# EAGLE design mini-v1.14-macrofab-rtg (EAGLE 7.5.0)

## Sheet 1 of 4: Main Microcontroller
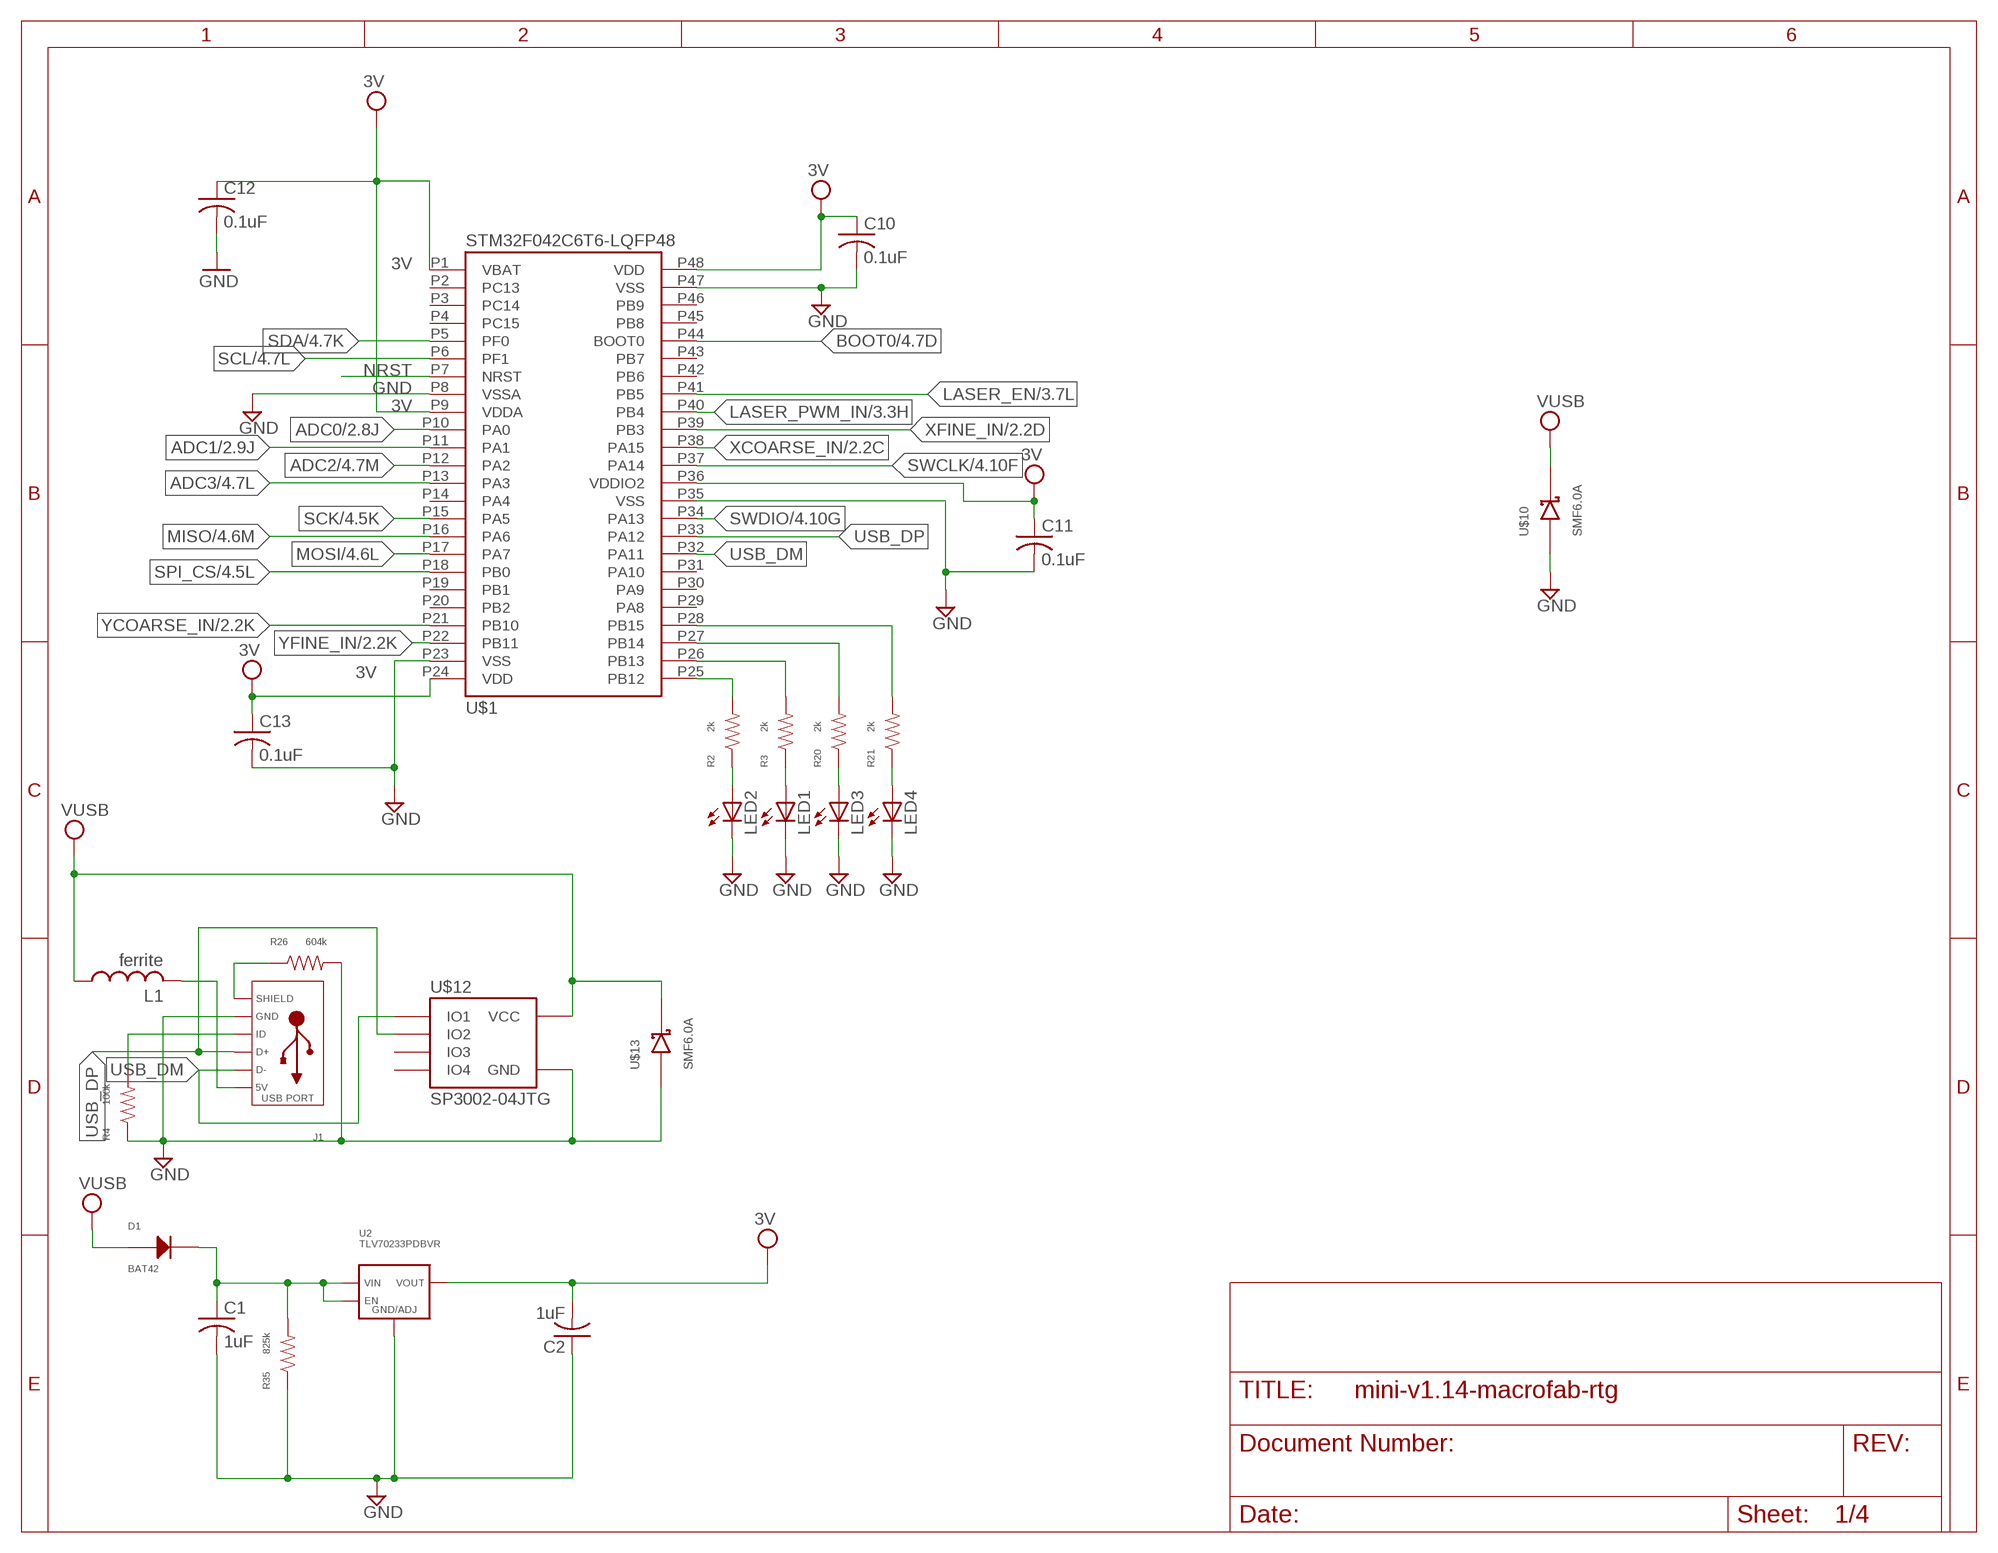
[diagram p0: schematic, sheet 1]

### Parts
C1  1uF  C-USC0603  [C0603]
C2  1uF  C-USC0603  [C0603]
C10  0.1uF  C-USC0603  [C0603]
C11  0.1uF  C-USC0603  [C0603]
C12  0.1uF  C-USC0603  [C0603]
C13  0.1uF  C-USC0603  [C0603]
D1  BAT42  DIODE_SOD-123  [SOD-123]
J1  USB_MICRO_RIGHT  [MICROUSB-RIGHT]
L1  ferrite  L-US  [C0603]
LED1  LEDCHIP-LED0603  [CHIP-LED0603]
LED2  LEDCHIP-LED0603  [CHIP-LED0603]
LED3  LEDCHIP-LED0603  [CHIP-LED0603]
LED4  LEDCHIP-LED0603  [CHIP-LED0603]
R2  2k  RESISTOR_0603  [R0603]
R3  2k  RESISTOR_0603  [R0603]
R4  100k  RESISTOR_0603  [R0603]
R20  2k  RESISTOR_0603  [R0603]
R21  2k  RESISTOR_0603  [R0603]
R26  604k  RESISTOR_0603  [R0603]
R35  825k  RESISTOR_0603  [R0603]
U2  TLV70233PDBVR  [SOT-23-5]
U$1  STM32F042C6T6-LQFP48  STM32F042-LQFP48  [LQFP48]
U$10  SMF6.0A  MBR0520  [SOD123]
U$12  SP3002-04JTG  SP3002  [SC70-6]
U$13  SMF6.0A  MBR0520  [SOD123]

### Nets
3V: C2.2 C10.1 C11.1 C12.1 C13.1 U2.P$5(VOUT) U$1.P1(VBAT) U$1.P9(VDDA) U$1.P24(VDD) U$1.P36(VDDIO2) U$1.P48(VDD) ; also sheet 2,4
ADC0: U$1.P10(PA0) ; also sheet 2
ADC1: U$1.P11(PA1) ; also sheet 2
ADC2: U$1.P12(PA2) ; also sheet 4
ADC3: U$1.P13(PA3) ; also sheet 4
BOOT0: U$1.P44(BOOT0) ; also sheet 4
GND [Power]: C1.2 C2.1 C10.2 C11.2 C12.2 C13.2 J1.5(GND) LED1.C LED2.C LED3.C LED4.C R4.P$1 R26.P$2 R35.P$1 U2.P$2(GND/ADJ) U$1.P8(VSSA) U$1.P23(VSS) U$1.P35(VSS) U$1.P47(VSS) U$10.ANODE U$12.P2(GND) U$13.ANODE ; also sheet 2,3,4
LASER_EN: U$1.P41(PB5) ; also sheet 3
LASER_PWM_IN: U$1.P40(PB4) ; also sheet 3
MISO: U$1.P16(PA6) ; also sheet 4
MOSI: U$1.P17(PA7) ; also sheet 4
N$2: R2.P$2 U$1.P25(PB12)
N$3: LED2.A R2.P$1
N$4: C1.1 D1.CATHODE R35.P$2 U2.P$1(VIN) U2.P$3(EN)
N$5: J1.4(ID) R4.P$2
N$12: LED1.A R3.P$1
N$13: R3.P$2 U$1.P26(PB13)
N$14: J1.1(5V) L1.2
N$18: J1.S1(SLD) J1.S2(SLD) J1.S3(SLD) J1.S4(SLD) J1.S5(SLD) J1.S6(SLD) R26.P$1
N$24: LED3.A R20.P$1
N$27: LED4.A R21.P$1
N$28: R20.P$2 U$1.P27(PB14)
N$29: R21.P$2 U$1.P28(PB15)
NRST: U$1.P7(NRST) ; also sheet 4
SCK: U$1.P15(PA5) ; also sheet 4
SCL: U$1.P6(PF1) ; also sheet 4
SDA: U$1.P5(PF0) ; also sheet 4
SPI_CS: U$1.P18(PB0) ; also sheet 4
SWCLK: U$1.P37(PA14) ; also sheet 4
SWDIO: U$1.P34(PA13) ; also sheet 4
USB_DM: J1.2(D-) U$1.P32(PA11) U$12.P1(IO1)
USB_DP: J1.3(D+) U$1.P33(PA12) U$12.P3(IO2)
VUSB [Power]: D1.ANODE L1.1 U$10.CATHODE U$12.P5(VCC) U$13.CATHODE ; also sheet 2,3,4
XCOARSE_IN: U$1.P38(PA15) ; also sheet 2
XFINE_IN: U$1.P39(PB3) ; also sheet 2
YCOARSE_IN: U$1.P21(PB10) ; also sheet 2
YFINE_IN: U$1.P22(PB11) ; also sheet 2
Unconnected: U$1.P2(PC13) U$1.P3(PC14) U$1.P4(PC15) U$1.P14(PA4) U$1.P19(PB1) U$1.P20(PB2) U$1.P29(PA8) U$1.P30(PA9) U$1.P31(PA10) U$1.P42(PB6) U$1.P43(PB7) U$1.P45(PB8) U$1.P46(PB9) U$12.P4(IO3) U$12.P6(IO4)

## Sheet 2 of 4: Dual PWM
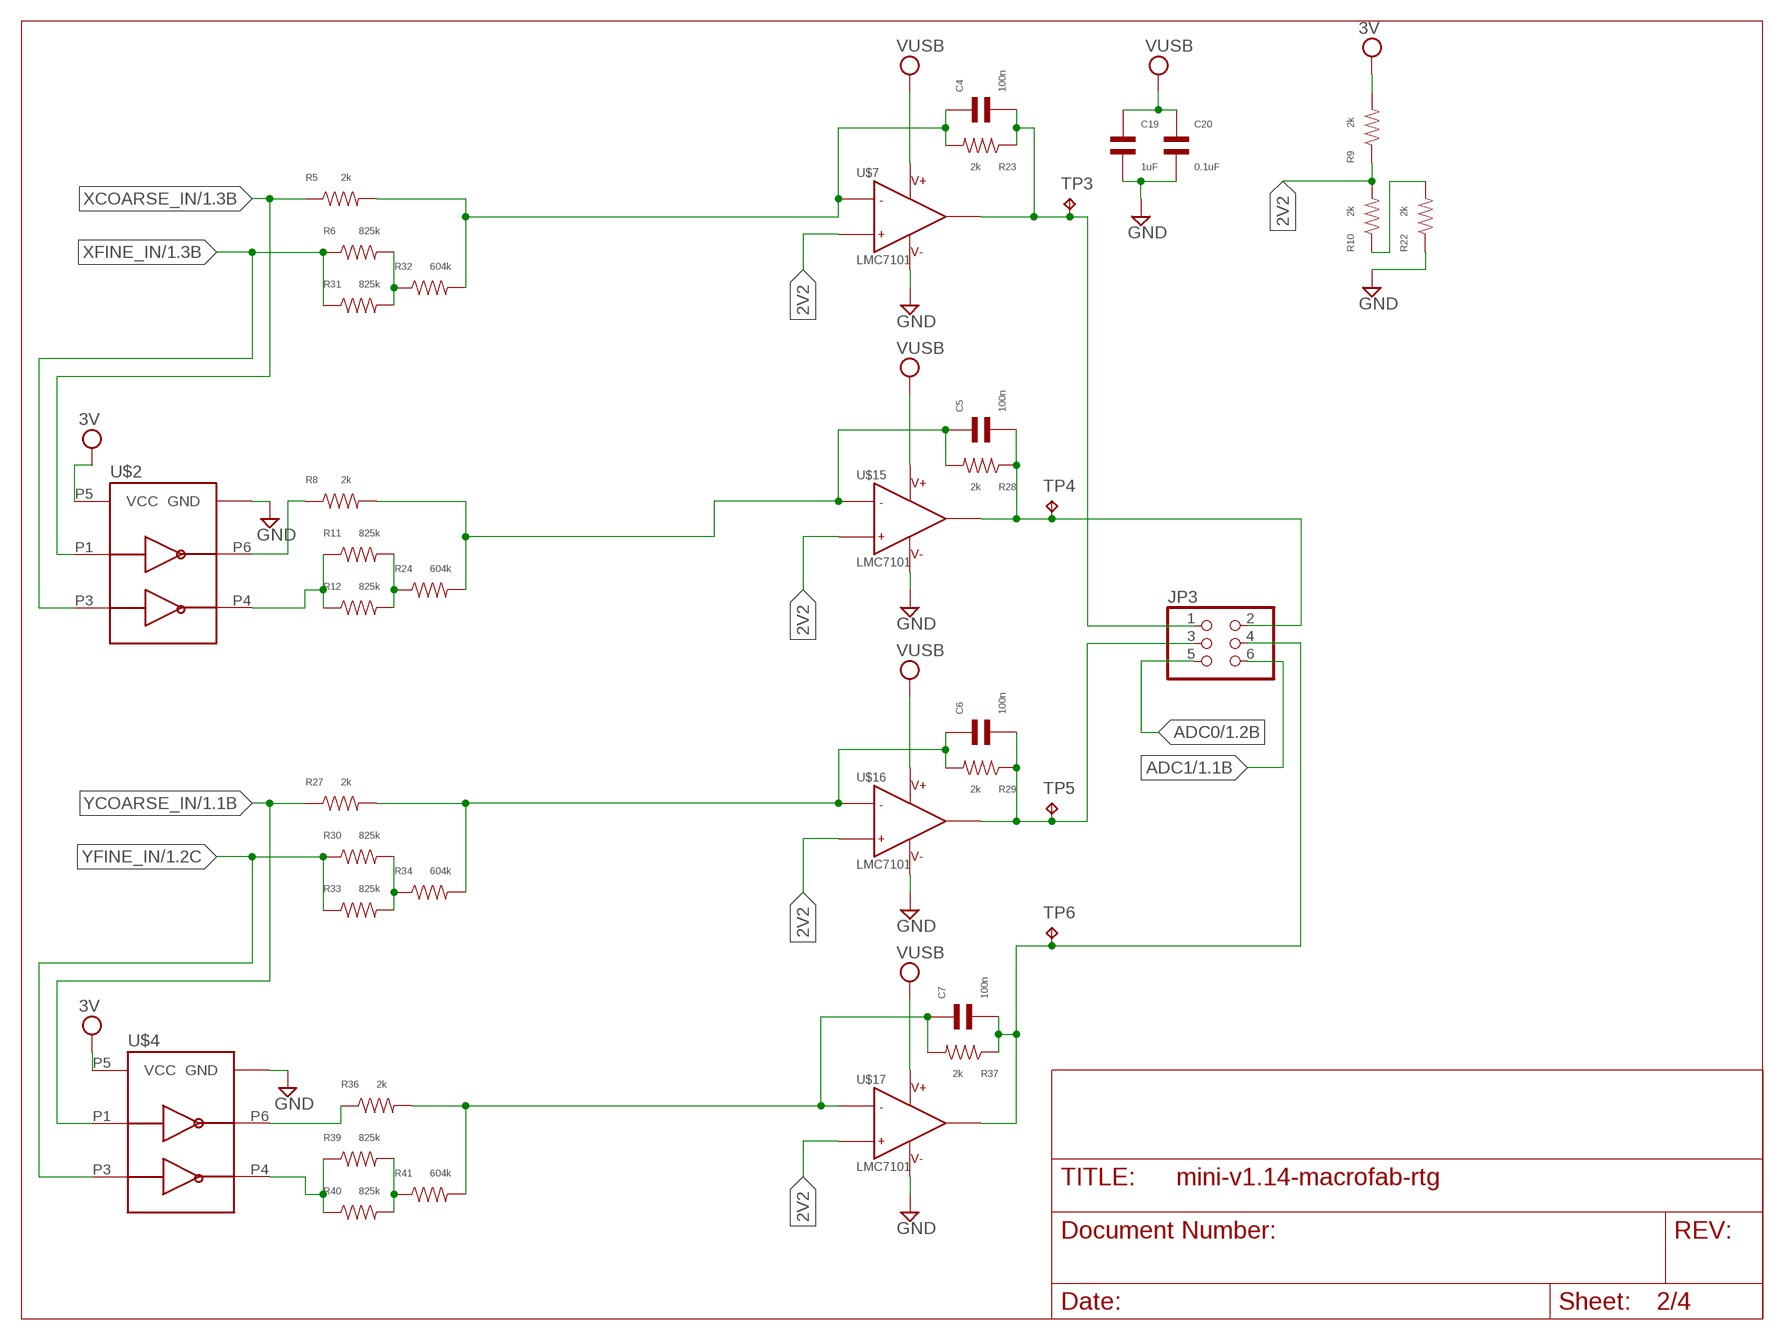
[diagram p1: schematic, sheet 2]

### Parts
C4  100n  CAPACITOR_NP_0603  [C0603]
C5  100n  CAPACITOR_NP_0603  [C0603]
C6  100n  CAPACITOR_NP_0603  [C0603]
C7  100n  CAPACITOR_NP_0603  [C0603]
C19  1uF  CAPACITOR_NP_0603  [C0603]
C20  0.1uF  CAPACITOR_NP_0603  [C0603]
JP3  PINHD-2X3  [2X03]
R5  2k  RESISTOR_0603  [R0603]
R6  825k  RESISTOR_0603  [R0603]
R8  2k  RESISTOR_0603  [R0603]
R9  2k  RESISTOR_0603  [R0603]
R10  2k  RESISTOR_0603  [R0603]
R11  825k  RESISTOR_0603  [R0603]
R12  825k  RESISTOR_0603  [R0603]
R22  2k  RESISTOR_0603  [R0603]
R23  2k  RESISTOR_0603  [R0603]
R24  604k  RESISTOR_0603  [R0603]
R27  2k  RESISTOR_0603  [R0603]
R28  2k  RESISTOR_0603  [R0603]
R29  2k  RESISTOR_0603  [R0603]
R30  825k  RESISTOR_0603  [R0603]
R31  825k  RESISTOR_0603  [R0603]
R32  604k  RESISTOR_0603  [R0603]
R33  825k  RESISTOR_0603  [R0603]
R34  604k  RESISTOR_0603  [R0603]
R36  2k  RESISTOR_0603  [R0603]
R37  2k  RESISTOR_0603  [R0603]
R39  825k  RESISTOR_0603  [R0603]
R40  825k  RESISTOR_0603  [R0603]
R41  604k  RESISTOR_0603  [R0603]
TP3  TPB1,27  [B1,27]
TP4  TPB1,27  [B1,27]
TP5  TPB1,27  [B1,27]
TP6  TPB1,27  [B1,27]
U$2  NC7WZ14P6X  [SC70-6]
U$4  NC7WZ14P6X  [SC70-6]
U$7  LMC7101  [SOT23-5]
U$15  LMC7101  [SOT23-5]
U$16  LMC7101  [SOT23-5]
U$17  LMC7101  [SOT23-5]

### Nets
2V2: R9.P$1 R10.P$2 U$7.3 U$15.3 U$16.3 U$17.3
3V: R9.P$2 U$2.P5(VCC) U$4.P5(VCC) ; also sheet 1,4
ADC0: JP3.5 ; also sheet 1
ADC1: JP3.6 ; also sheet 1
COARSE1: R8.P$1 U$2.P6(Y1)
FINE1: R11.P$1 R12.P$1 U$2.P4(Y2)
FINE3: R39.P$1 R40.P$1 U$4.P4(Y2)
GND [Power]: C19.P$2 C20.P$2 R22.P$1 U$2.P2(GND) U$4.P2(GND) U$7.5 U$15.5 U$16.5 U$17.5 ; also sheet 1,3,4
N$7: R36.P$1 U$4.P6(Y1)
N$8: R11.P$2 R12.P$2 R24.P$1
N$10: C5.P$1 R8.P$2 R24.P$2 R28.P$2 U$15.4
N$22: R10.P$1 R22.P$2
N$30: R30.P$2 R33.P$2 R34.P$1
N$31: R6.P$2 R31.P$2 R32.P$1
N$32: C6.P$1 R27.P$2 R29.P$2 R34.P$2 U$16.4
N$35: R39.P$2 R40.P$2 R41.P$1
N$36: C7.P$1 R36.P$2 R37.P$2 R41.P$2 U$17.4
OUT: C4.P$2 JP3.1 R23.P$1 TP3.TP U$7.1
OUT1: C5.P$2 JP3.2 R28.P$1 TP4.TP U$15.1
OUT2: C6.P$2 JP3.3 R29.P$1 TP5.TP U$16.1
OUT3: C7.P$2 JP3.4 R37.P$1 TP6.TP U$17.1
VUSB [Power]: C19.P$1 C20.P$1 U$7.2 U$15.2 U$16.2 U$17.2 ; also sheet 1,3,4
XCOARSE_IN: R5.P$1 U$2.P1(A1) ; also sheet 1
XFINE_IN: R6.P$1 R31.P$1 U$2.P3(A2) ; also sheet 1
XSUM: C4.P$1 R5.P$2 R23.P$2 R32.P$2 U$7.4
YCOARSE_IN: R27.P$1 U$4.P1(A1) ; also sheet 1
YFINE_IN: R30.P$1 R33.P$1 U$4.P3(A2) ; also sheet 1

## Sheet 3 of 4: Laser Power Driver
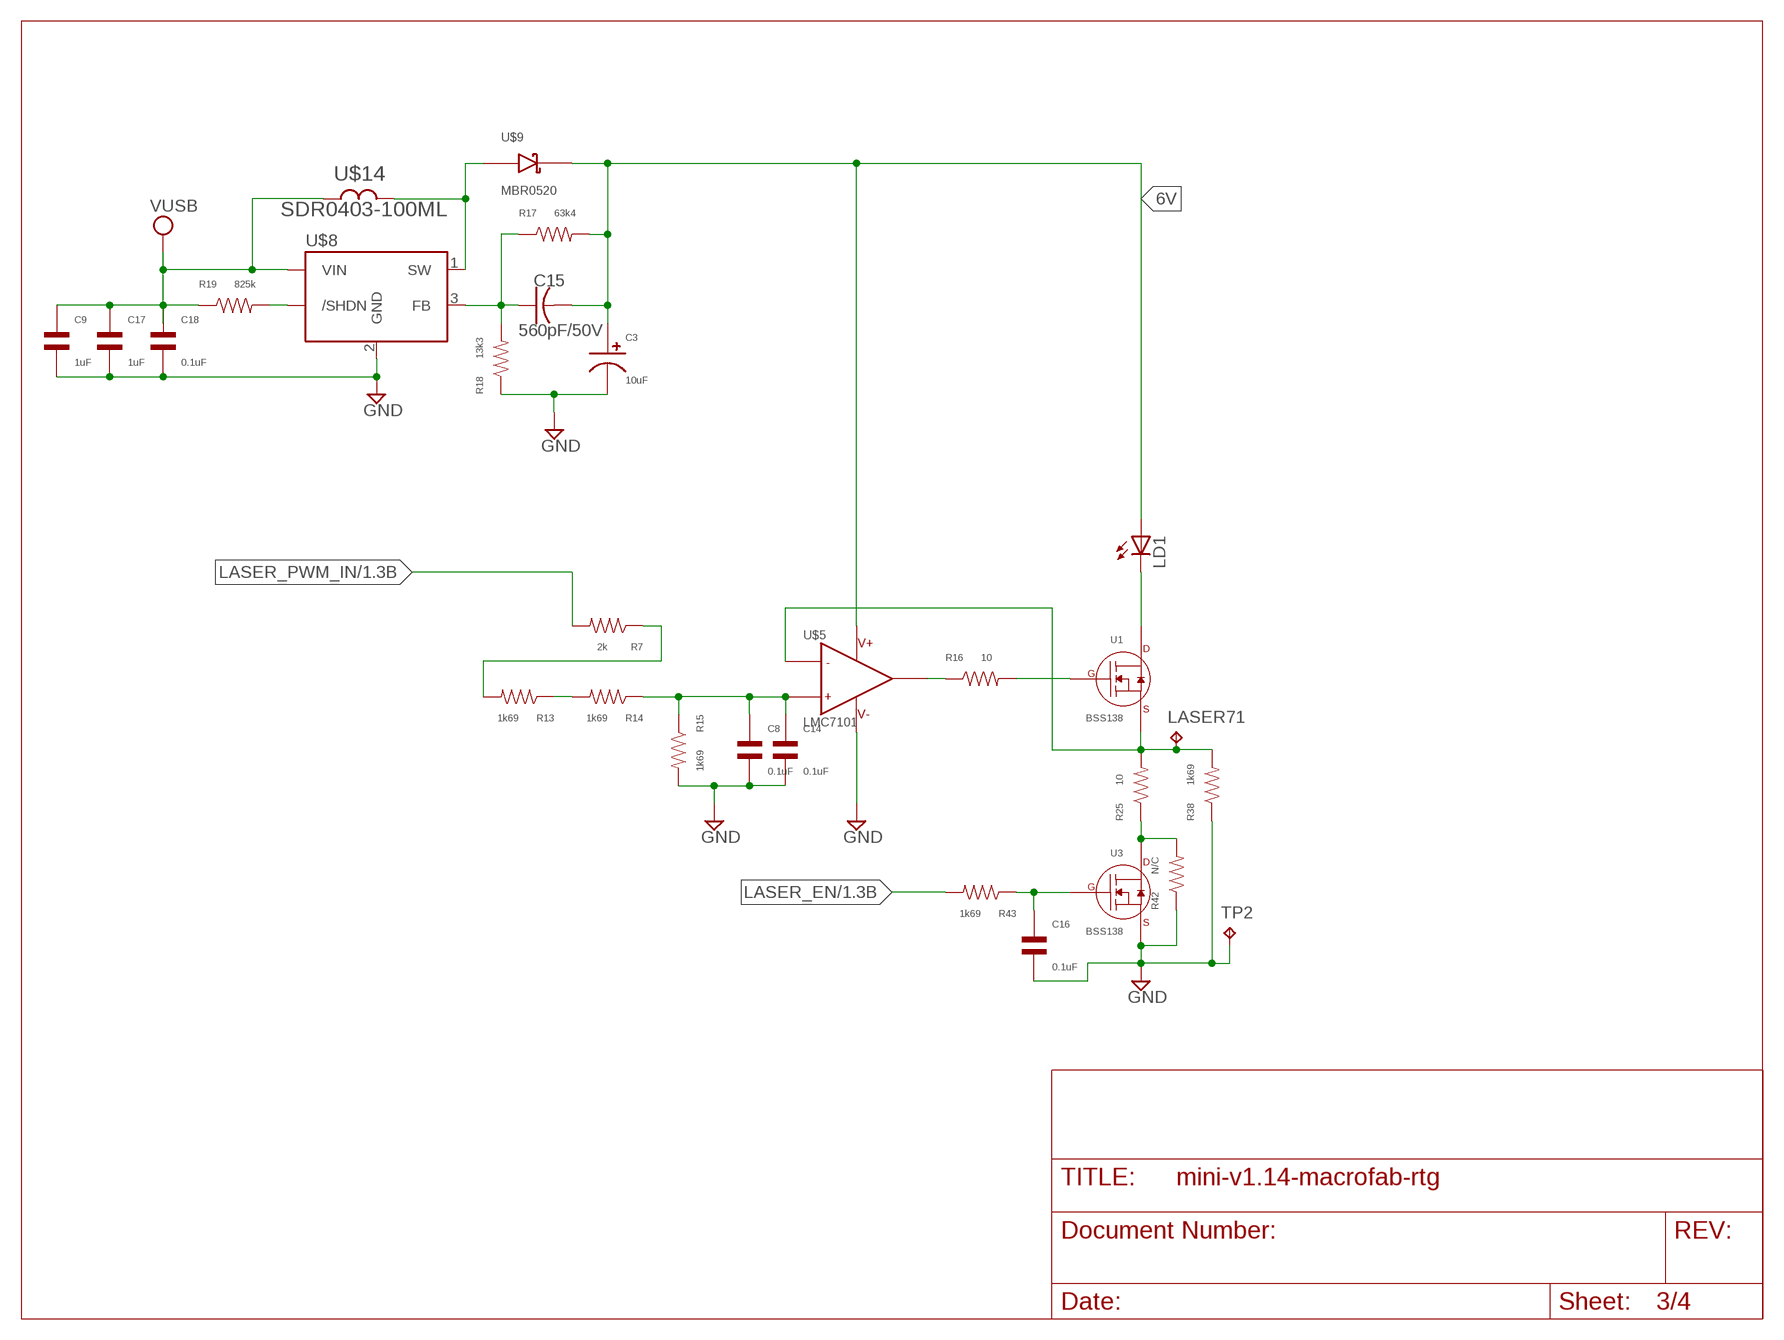
[diagram p2: schematic, sheet 3]

### Parts
C3  10uF  CAPACITOR_P_4MM  [CP4MM]
C8  0.1uF  CAPACITOR_NP_0603  [C0603]
C9  1uF  CAPACITOR_NP_0603  [C0603]
C14  0.1uF  CAPACITOR_NP_0603  [C0603]
C15  560pF/50V  C-USC0603  [C0603]
C16  0.1uF  CAPACITOR_NP_0603  [C0603]
C17  1uF  CAPACITOR_NP_0603  [C0603]
C18  0.1uF  CAPACITOR_NP_0603  [C0603]
LASER71  TPB2,54  [B2,54]
LD1  SCOTT_LASERDIODELD3  [SCOTT_LASERDIODE3]
R7  2k  RESISTOR_0603  [R0603]
R13  1k69  RESISTOR_0603  [R0603]
R14  1k69  RESISTOR_0603  [R0603]
R15  1k69  RESISTOR_0603  [R0603]
R16  10  RESISTOR_0603  [R0603]
R17  63k4  RESISTOR_0603  [R0603]
R18  13k3  RESISTOR_0603  [R0603]
R19  825k  RESISTOR_0603  [R0603]
R25  10  RESISTOR_0603  [R0603]
R38  1k69  RESISTOR_0603  [R0603]
R42  N/C  RESISTOR_0603  [R0603]
R43  1k69  RESISTOR_0603  [R0603]
TP2  GND  TPB2,54  [B2,54]
U1  BSS138  N-CHANNEL_FET_SOT-23-3  [SOT-23-3]
U3  BSS138  N-CHANNEL_FET_SOT-23-3  [SOT-23-3]
U$5  LMC7101  OPAMP-SINGLELMC7101  [SOT23-5]
U$8  LMR62014  [SOT23-5]
U$9  MBR0520  [SOD123]
U$14  SDR0403-100ML  SDR0403  [SDR0403]

### Nets
6V [Power]: C3.P$1 C15.2 LD1.P$1(A) R17.P$2 U$5.2(V+) U$9.CATHODE
GND [Power]: C3.P$2 C8.P$2 C9.P$2 C14.P$2 C16.P$2 C17.P$2 C18.P$2 R15.P$2 R18.P$1 R38.P$1 R42.P$1 TP2.TP U3.P$2(SOURCE) U$5.5(V-) U$8.2(GND) ; also sheet 1,2,4
LASER_EN: R43.P$2 ; also sheet 1
LASER_PWM_IN: R7.P$2 ; also sheet 1
N$1: R25.P$1 R42.P$2 U3.P$3(DRAIN)
N$6: R7.P$1 R13.P$2
N$9: R13.P$1 R14.P$2
N$11: C8.P$1 C14.P$1 R14.P$1 R15.P$1 U$5.3(IN+)
N$15: U$8.1(SW) U$9.ANODE U$14.P$2
N$16 [Power]: LD1.P$3(C) U1.P$3(DRAIN)
N$17 [Power]: LASER71.TP R25.P$2 R38.P$2 U1.P$2(SOURCE) U$5.4(IN-)
N$19 [Power]: R16.P$2 U1.P$1(GATE)
N$20: R16.P$1 U$5.1(OUT)
N$21: C16.P$1 R43.P$1 U3.P$1(GATE)
N$25: C15.1 R17.P$1 R18.P$2 U$8.3(FB)
N$26: R19.P$2 U$8.4(/SHDN)
VUSB [Power]: C9.P$1 C17.P$1 C18.P$1 R19.P$1 U$8.5(VIN) U$14.P$1 ; also sheet 1,2,4

## Sheet 4 of 4
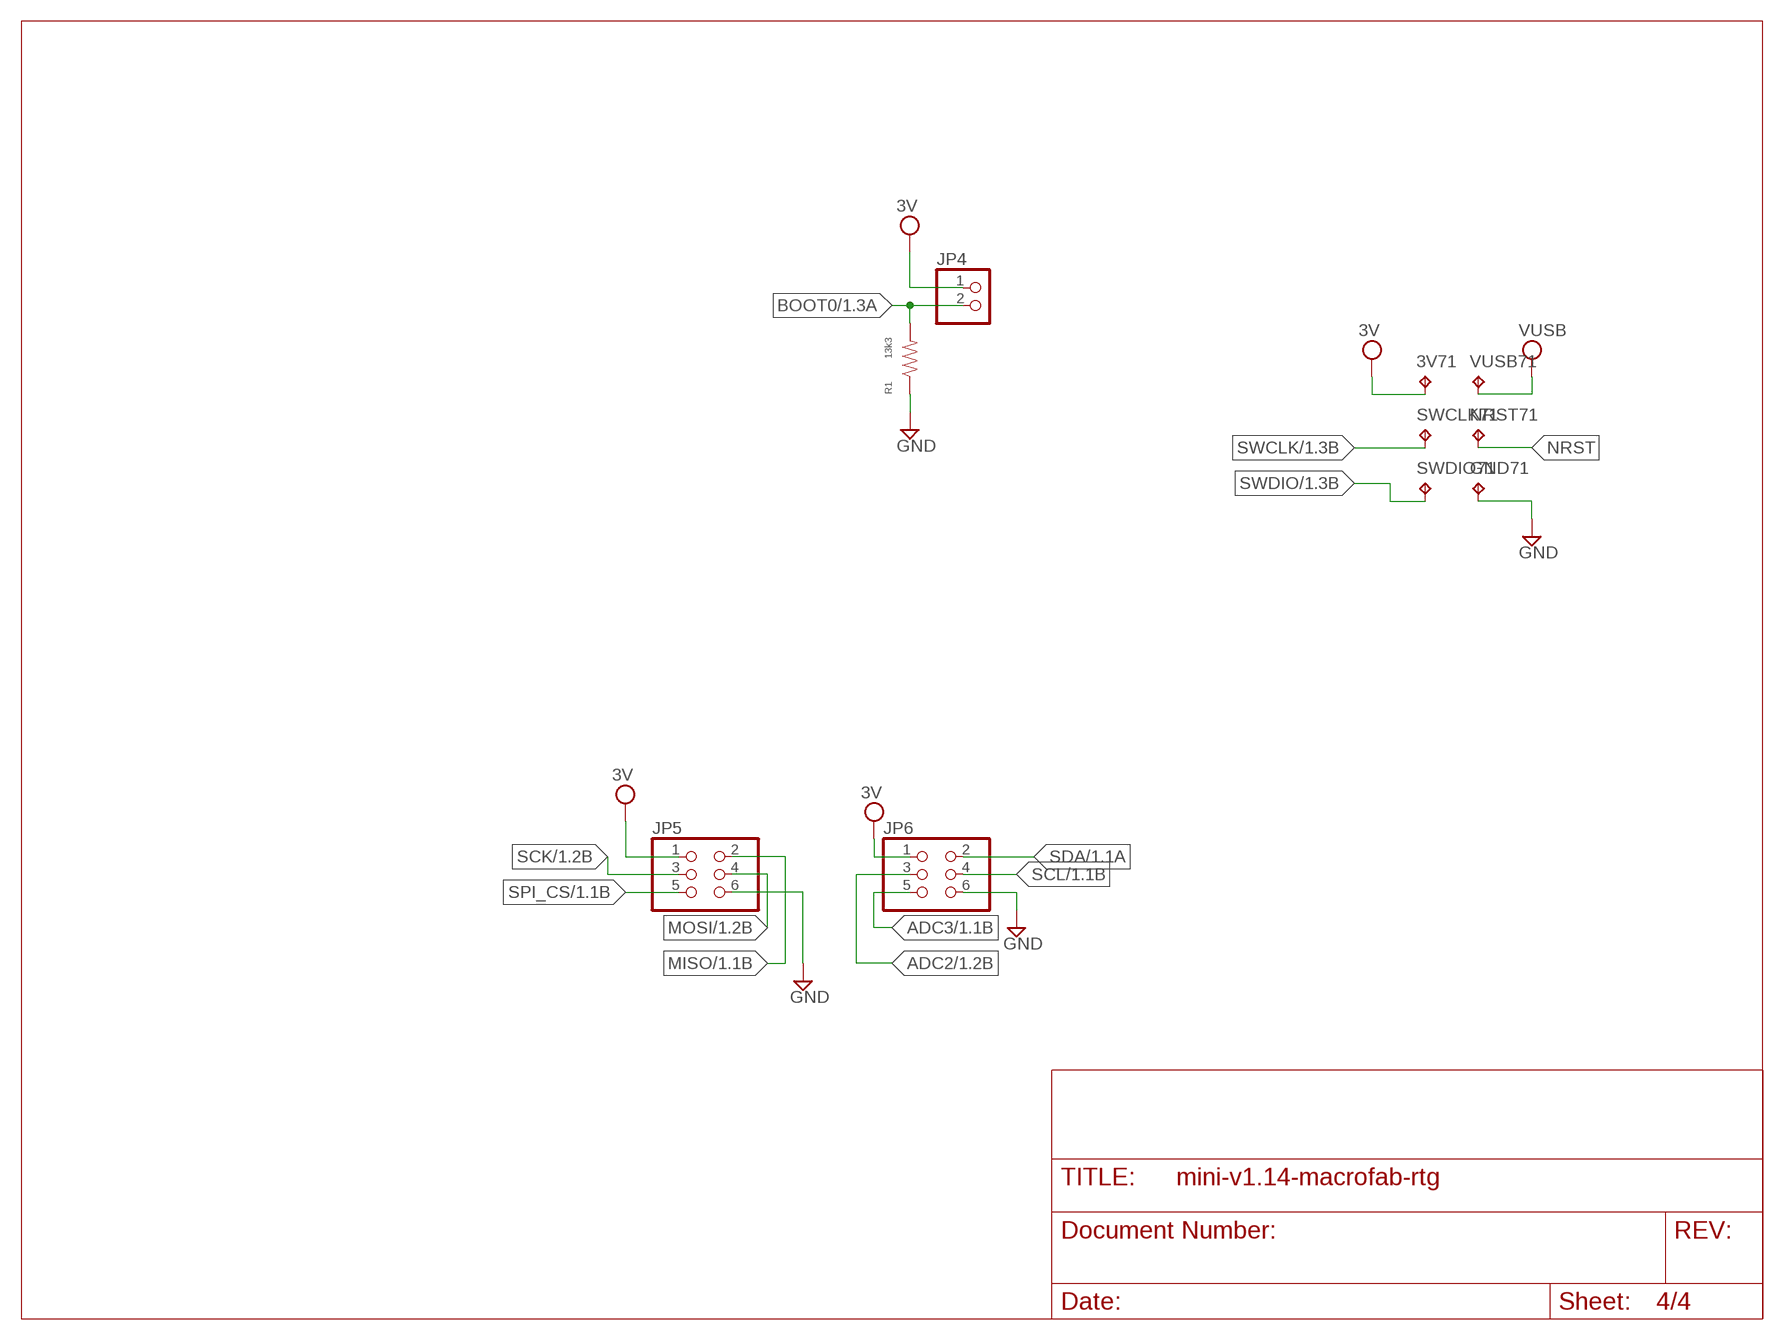
[diagram p3: schematic, sheet 4]

### Parts
3V71  TPB1,27  [B1,27]
GND71  TPB1,27  [B1,27]
JP4  PINHD-1X2  [1X02]
JP5  PINHD-2X3  [2X03]
JP6  PINHD-2X3  [2X03]
NRST71  TPB1,27  [B1,27]
R1  13k3  RESISTOR_0603  [R0603]
SWCLK71  TPB1,27  [B1,27]
SWDIO71  TPB1,27  [B1,27]
VUSB71  TPB1,27  [B1,27]

### Nets
3V: 3V71.TP JP4.1 JP5.1 JP6.1 ; also sheet 1,2
ADC2: JP6.3 ; also sheet 1
ADC3: JP6.5 ; also sheet 1
BOOT0: JP4.2 R1.P$2 ; also sheet 1
GND [Power]: GND71.TP JP5.6 JP6.6 R1.P$1 ; also sheet 1,2,3
MISO: JP5.2 ; also sheet 1
MOSI: JP5.4 ; also sheet 1
NRST: NRST71.TP ; also sheet 1
SCK: JP5.3 ; also sheet 1
SCL: JP6.4 ; also sheet 1
SDA: JP6.2 ; also sheet 1
SPI_CS: JP5.5 ; also sheet 1
SWCLK: SWCLK71.TP ; also sheet 1
SWDIO: SWDIO71.TP ; also sheet 1
VUSB [Power]: VUSB71.TP ; also sheet 1,2,3

## Library data of the parts
3V71 GND71 LASER71 NRST71 SWCLK71 SWDIO71 TP2-TP6 VUSB71 = testpad:TP: Test pad
C1 C2 C10-C13 C15 = rcl:C-US: CAPACITOR, American symbol
C3 = MF_Passives:CAPACITOR_P: Library: MF_Passives Description: Device for Polarized Capacitors. Manufacture part number (MFG#), Voltage Rating, and Tolerance can be added via Attributes.; MFG#: N/A; TOLERANCE: N/A; VOLTAGE: N/A
C4-C9 C14 C16-C20 = MF_Passives:CAPACITOR_NP: Library: MF_Passives Description: Device for Non-Polarized Capacitors. Manufacture part number (MFG#), Voltage, Temperature Coefficient, and Tolerance can be added via Attributes.; MFG#: N/A; TEMP_COF: N/A; TOLERANCE: N/A; VOLTAGE: N/A
D1 = MF_Discrete_Semiconductor:DIODE: Library: MF_Discrete_Semiconductor Description: Device for Single Packaged Diodes. Manufacture part number (MFG#) can be added via Attributes.; MFG#: N/A
J1 = MF_Connectors:USB: Library: MF_Connectors Description: 5 Pin USB Connectors. SLD is the shield connection. Usually tied to ground through a small ferrite bead.
JP3 JP5 JP6 = pinhead:PINHD-2X3: PIN HEADER
JP4 = pinhead:PINHD-1X2: PIN HEADER
L1 = lmdparts:L-US: INDUCTOR, American symbol
LD1 = mini-v1.14-macrofab-rtg:SCOTT_LASERDIODE; MPN: 3 x (0552-2-15-15-11-27-10-0)
LED1-LED4 = adafruit:LED: LED OSRAM: - CHIPLED LG R971, LG N971, LY N971, LG Q971, LY Q971, LO R971, LY R971 LH N974, LH R974 LS Q976, LO Q976, LY Q976 LO Q996 - Hyper CHIPLED LW Q18S LB Q993, LB Q99A, LB R99A - SideLED LS A670, LO A670, LY A670, LG A670, LP A670 LB A673, LV A673, LT A673, LW A673 LH A674 LY A675 LS A676, LA A676, LO A676, LY A676, LW A676 LS A679, LY A679, LG A679 - Hyper Micro SIDELED® LS Y876, LA Y876, LO Y876, LY Y876 LT Y87S - SmartLED LW L88C, LW L88S LB L89C, LB L89S, LG L890 LS L89K, LO L89K, LY L89K LS L896, LA L896, LO L896, LY L896 - TOPLED LS T670, LO T670, LY T670, LG T670, LP T670 LSG T670, LSP T670, LSY T670, LOP T670, LYG T670 LG T671, LOG T671, LSG T671 LB T673, LV T673, LT T673, LW T673 LH T674 LS T676, LA T676, LO T676, LY T676, LB T676, LH T676, LSB T676, LW T676 LB T67C, LV T67C, LT T67C, LS T67K, LO T67K, LY T67K, LW E67C LS E67B, LA E67B, LO E67B, LY E67B, LB E67C, LV E67C, LT E67C LW T67C LS T679, LY T679, LG T679 LS T770, LO T770, LY T770, LG T770, LP T770 LB T773, LV T773, LT T773, LW T773 LH T774 LS E675, LA E675, LY E675, LS T675 LS T776, LA T776, LO T776, LY T776, LB T776 LHGB T686 LT T68C, LB T68C - Hyper Mini TOPLED® LB M676 - Mini TOPLED Santana® LG M470 LS M47K, LO M47K, LY M47K Source: http://www.osram.convergy.de/
R1-R43 = MF_Passives:RESISTOR: Library: MF_Passives Description: Device for Resistors. Manufacture part number (MFG#), Voltage, Tolerance, and Wattage Rating can be added via Attributes.; MFG#: N/A; TOLERANCE: N/A; VOLTAGE: N/A; WATTAGE: N/A
U1 U3 = MF_Discrete_Semiconductor:N-CHANNEL_FET: Library: MF_Discrete_Semiconductor Description: Device for Single N-Channel Mosfet. Manufacture part number (MFG#) can be added via Attributes.
U2 = MF_IC_Power:TLV702: Manufacturer Part #: TLV702 Manufacturer: Texas Instruments Description: LDO Voltage Regulators
U$1 = lmdparts:STM32F042-LQFP48
U$2 U$4 = lmdparts:NC7WZ14P6X: 2-circuit logic inverter, ultra-high-speed and cheap
U$5 = lmdparts:OPAMP-SINGLE: Single amp opamps
U$7 U$15-U$17 = lmdparts:LMC7101
U$8 = lmdparts:LMR62014
U$9 U$10 U$13 = lmdparts:MBR0520
U$12 = lmdparts:SP3002
U$14 = lmdparts:SDR0403

## Net classes
1 Power: width 0.305 mm

## Board
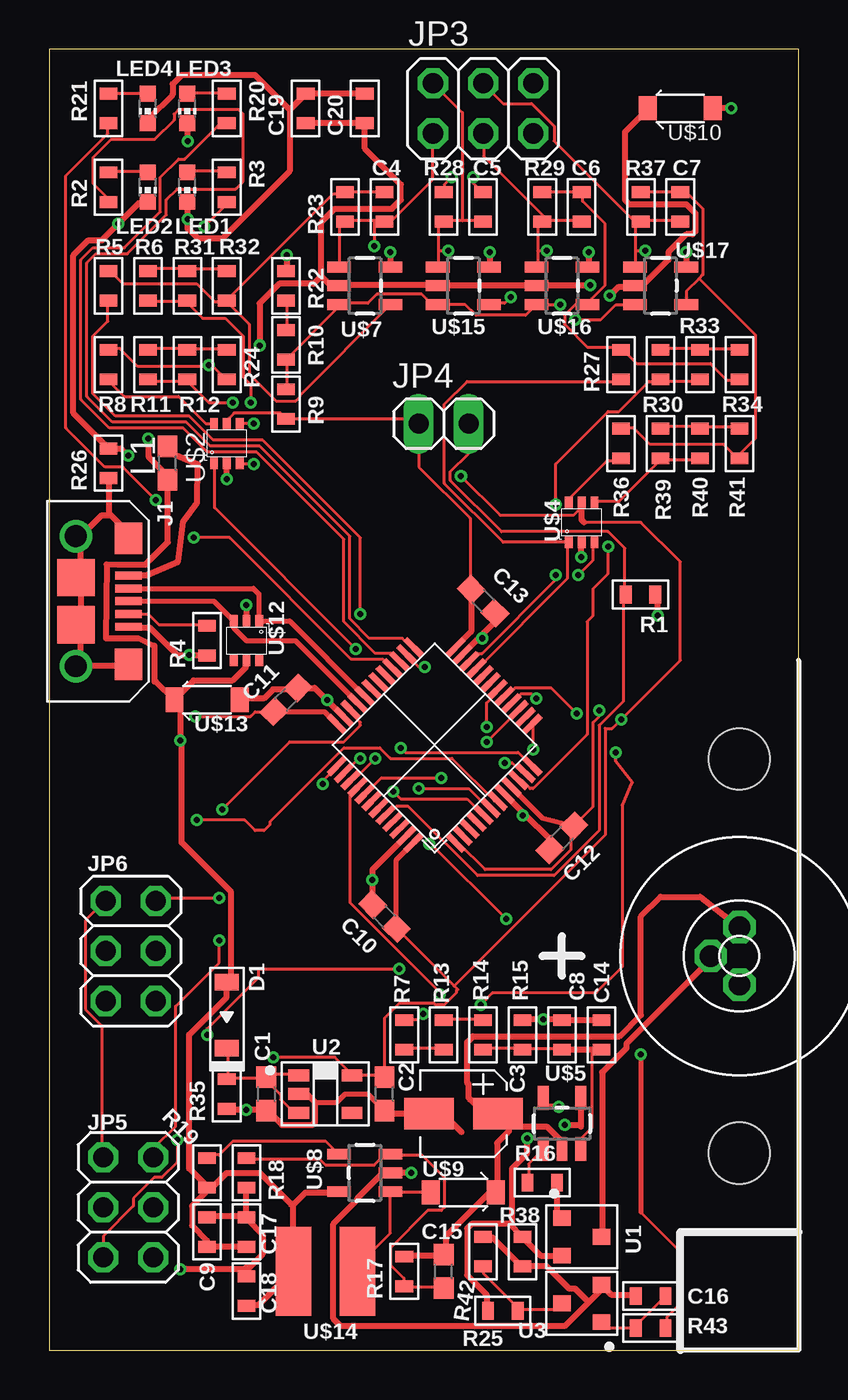
[diagram p4: board, top side]
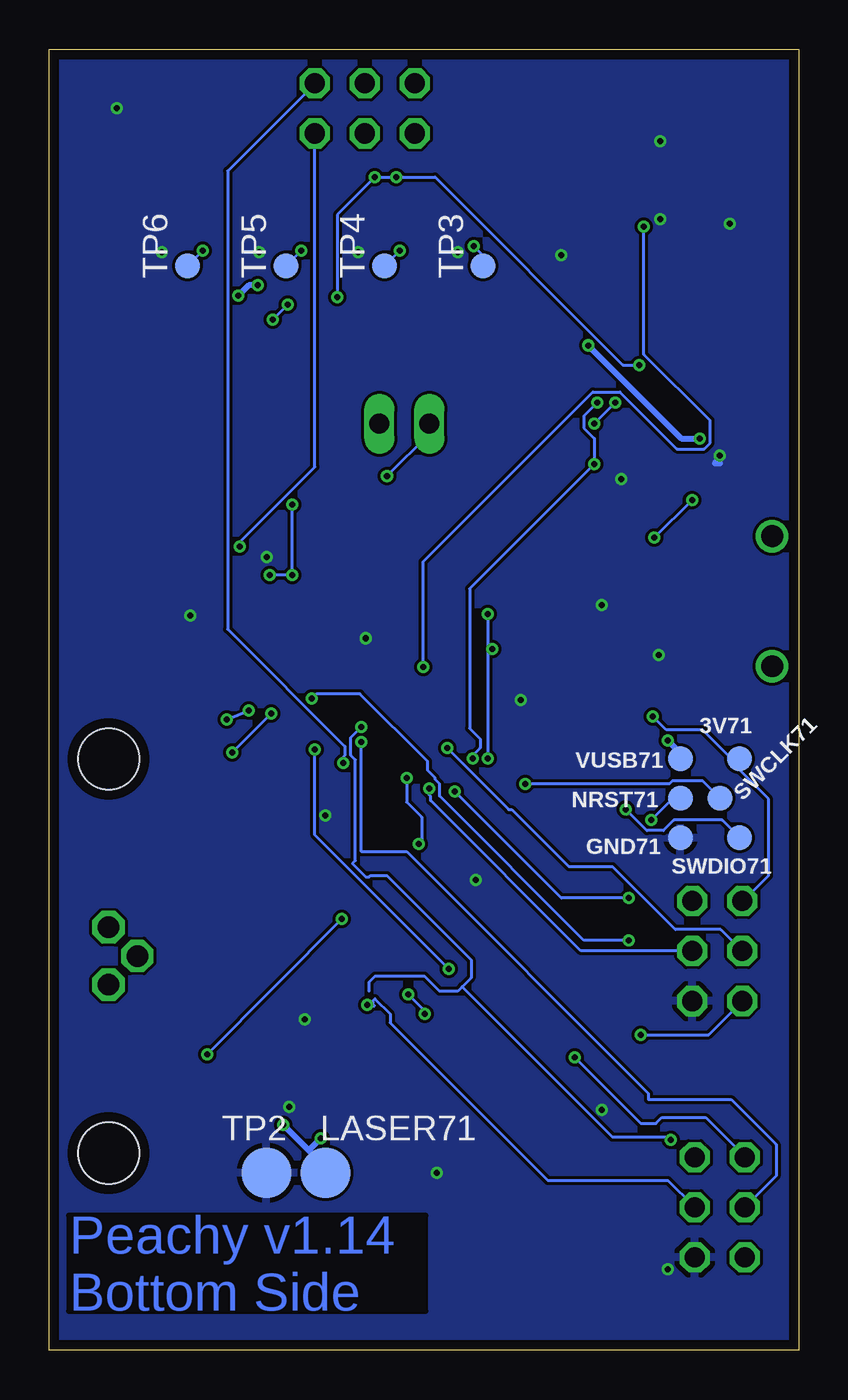
[diagram p5: board, bottom side, seen from below]

Size 38.01 x 66 mm. Coordinates in mm from the lower left corner, seen from the top.
Outline: 0,0 38.01,0 38,66 0,66 0,0
Copper layers (1*16): Top 0.035mm / dielectric 1.5mm / Bottom 0.035mm
Design rules "SeeedStudio_2layer_DRU_no_angle_20140221 *": minimum track width 6mil, minimum drill 12mil, track to track 6mil, track to pad 6mil, pad to pad 6mil, via to via 6mil, smd to smd 0mil, copper to edge 20mil, drill to drill 10mil, minimum pad ring 10mil, minimum via ring 6mil, stop-mask expansion 2mil, vias tented up to drill 100mil, thermal gap 10mil
Holes 3.1 mm at 35,10 35,30
tKeepout: area 31,26 to 39,34; area 31,6 to 39,14
bKeepout: area 31,26 to 39,34; area 31,6 to 39,14

### Footprints (pad centres in the part's own frame; a part is rotated, then mirrored left to right if it is on the bottom)
B1,27 = smd 1.27 x 1.27: TP 0,0
C0603 = smd 1.1 x 1: 1 -0.85,0; 2 0.85,0
CP4MM = smd 1.6 x 2.5: P$1 0,-1.75; P$2 0,1.75
C0603' = smd 0.6 x 0.9: P$1 -0.75,0; P$2 0.75,0
SOD-123 = smd 0.85 x 1.2: ANODE 1.675,0; CATHODE -1.675,0
MICROUSB-RIGHT = smd 0.4 x 1.35: 1 -1.3,1.27; 2 -0.65,1.27; 3 0,1.27; 4 0.65,1.27; 5 1.3,1.27 | drill 1.1: S1 -3.3,-1.405; S2 3.3,-1.405 | smd 1.6 x 1.4: S3 -3.2,1.27; S4 3.2,1.27 | smd 1.9 x 1.9: S5 -1.2,-1.405; S6 1.2,-1.405
2X03 = drill 1.016 octagon: 1 -2.54,-1.27; 2 -2.54,1.27; 3 0,-1.27; 4 0,1.27; 5 2.54,-1.27; 6 2.54,1.27
1X02 = drill 1.016 long: 1 -1.27,0; 2 1.27,0
B2,54 = smd 2.54 x 2.54: TP 0,0
SCOTT_LASERDIODE3 = drill 1.092 pad 1.499 octagon: P$1 0,1.457; P$2 0,-1.457; P$3 -1.457,0
CHIP-LED0603 = smd 0.8 x 0.8: A 0,-0.75; C 0,0.75
R0603 = smd 0.6 x 0.9: P$1 -0.75,0; P$2 0.75,0
SOT-23-3 = smd 0.8 x 0.9: P$1 -0.95,-1; P$2 0.95,-1; P$3 0,1
SOT-23-5 = smd 1.05 x 0.6: P$1 -1.35,0.95; P$2 -1.35,0; P$3 -1.35,-0.95; P$4 1.35,-0.95; P$5 1.35,0.95
LQFP48 = smd 0.3 x 1.2: P1 -2.75,-0.6; P2 -2.25,-0.6; P3 -1.75,-0.6; P4 -1.25,-0.6; P5 -0.75,-0.6; P6 -0.25,-0.6; P7 0.25,-0.6; P8 0.75,-0.6; P9 1.25,-0.6; P10 1.75,-0.6; P11 2.25,-0.6; P12 2.75,-0.6; P25 2.75,7.9; P26 2.25,7.9; P27 1.75,7.9; P28 1.25,7.9; P29 0.75,7.9; P30 0.25,7.9; P31 -0.25,7.9; P32 -0.75,7.9; P33 -1.25,7.9; P34 -1.75,7.9; P35 -2.25,7.9; P36 -2.75,7.9 | smd 1.2 x 0.3: P13 4.25,0.9; P14 4.25,1.4; P15 4.25,1.9; P16 4.25,2.4; P17 4.25,2.9; P18 4.25,3.4; P19 4.25,3.9; P20 4.25,4.4; P21 4.25,4.9; P22 4.25,5.4; P23 4.25,5.9; P24 4.25,6.4; P37 -4.25,6.4; P38 -4.25,5.9; P39 -4.25,5.4; P40 -4.25,4.9; P41 -4.25,4.4; P42 -4.25,3.9; P43 -4.25,3.4; P44 -4.25,2.9; P45 -4.25,2.4; P46 -4.25,1.9; P47 -4.25,1.4; P48 -4.25,0.9
SC70-6 = smd 0.4 x 0.6: P1 -0.65,-1; P2 0,-1; P3 0.65,-1; P4 0.65,1; P5 0,1; P6 -0.65,1
SOT23-5 = smd 0.55 x 1.2: 1 -0.95,-1.3; 2 0,-1.3; 3 0.95,-1.3; 4 0.95,1.3; 5 -0.95,1.3
SOD123 = smd 0.91 x 1.22: ANODE -1.65,0; CATHODE 1.65,0
SDR0403 = smd 4.5 x 1.8: P$1 0,1.625; P$2 0,-1.625

### Placement (x,y rotation side)
3V71  3,30 0 bottom
C1  11,13 270 top
C2  17,13 90 top
C3  21,12 90 top
C4  100n  [C0603']  17,58 270 top
C5  100n  [C0603']  22,58 270 top
C6  100n  [C0603']  27,58 270 top
C7  100n  [C0603']  32,58 270 top
C8  0.1uF  [C0603']  26,16 90 top
C9  1uF  [C0603']  8,6 90 top
C10  17,22 135 top
C11  12,33 45 top
C12  26,26 225 top
C13  22,38 315 top
C14  0.1uF  [C0603']  28,16 90 top
C15  20,4 90 top
C16  0.1uF  [C0603']  30.5,2.75 180 top
C17  1uF  [C0603']  10,6 90 top
C18  0.1uF  [C0603']  10,3 90 top
C19  1uF  [C0603']  13,63 90 top
C20  0.1uF  [C0603']  16,63 90 top
D1  9,17 90 top
GND71  6,26 0 bottom
J1  2.75,38 270 top
JP3  22,63 0 top
JP4  20,47 0 top
JP5  4,7.25 270 top
JP6  4.12,20.25 270 top
L1  6,45 90 top
LASER71  24,9 0 bottom
LD1  35,20 0 top
LED1  7,59 180 top
LED2  5,59 180 top
LED3  7,63 180 top
LED4  5,63 180 top
NRST71  6,28 0 bottom
R1  29.98,38.34 180 top
R2  3,59 270 top
R3  9,59 270 top
R4  8,36 90 top
R5  3,54 90 top
R6  5,54 90 top
R7  18,16 90 top
R8  3,50 90 top
R9  12,48 270 top
R10  12,51 270 top
R11  5,50 90 top
R12  7,50 90 top
R13  20,16 270 top
R14  22,16 90 top
R15  24,16 90 top
R16  25,8.5 0 top
R17  18,4 90 top
R18  10,9 90 top
R19  8,9 90 top
R20  9,63 270 top
R21  3,63 270 top
R22  12,54 270 top
R23  15,58 90 top
R24  9,50 270 top
R25  23,2 180 top
R26  3,45 90 top
R27  29,50 90 top
R28  20,58 90 top
R29  25,58 90 top
R30  31,50 90 top
R31  7,54 90 top
R32  9,54 270 top
R33  33,50 90 top
R34  35,50 270 top
R35  9,13 90 top
R36  29,46 90 top
R37  30,58 90 top
R38  24,5 90 top
R39  31,46 90 top
R40  33,46 90 top
R41  35,46 270 top
R42  22,5 270 top
R43  30.5,1.12 0 top
SWCLK71  4,28 0 bottom
SWDIO71  3,26 0 bottom
TP2  27,9 0 bottom
TP3  16,55 90 bottom
TP4  21,55 90 bottom
TP5  26,55 90 bottom
TP6  31,55 90 bottom
U1  27,5.75 270 top
U2  14,13 0 top
U3  27,2.38 90 top
U$1  22.12,28.12 45 top
U$2  9,46 0 top
U$4  27,42 0 top
U$5  26,11.5 0 top
U$7  16,54 270 top
U$8  16,9 90 top
U$9  21,8 0 top
U$10  32,63 180 top
U$12  10,36 180 top
U$13  8,33 180 top
U$14  14,4 90 top
U$15  21,54 270 top
U$16  26,54 270 top
U$17  31,54 270 top
VUSB71  6,30 0 bottom

### Tracks (layer width: path | path; a pad name or v marks a point on that pad's centre or on a via)
2V2  (via drill 0.3)
  Top 0.152: R9.P$1 12.04,48.77 12.04,50.22 R10.P$2 12.04,50.29 14.63,52.88 14.63,53.03 U$7.3 14.71,53.11 16.15,53.11 16.61,53.57 18.9,53.57 19.36,53.11 19.66,53.11 U$15.3 19.74,53.03 21.11,53.03 21.64,52.5 24.16,52.5 24.69,53.03 U$16.3 24.77,53.03 v25.91,53.03 | v26.67,52.27 27.96,52.27 28.73,53.03 29.64,53.03 U$17.3
  Bottom 0.152: v25.91,53.03 v26.67,52.27
3V  (via drill 0.3)
  Top 0.152: 20.54,18.48 17.68,21.34 C10.1 | 20.54,18.48 20.69,18.33 | 20.69,18.33 20.73,18.29 | U$1.P1 20.65,25.68 20.8,25.68 22.1,24.38 25.45,24.38 26.44,25.38 26.44,26.52 C12.1 27.58,27.58 27.58,31.85 27.89,32.16 v27.89,32.46 | 21.34,38.71 C13.1 21.34,38.79 21.34,42.22 18.75,44.81 18.75,46.94 JP4.1 18.67,47.02 18.44,47.24 12.04,47.24 R9.P$2 11.96,47.32 11.73,47.55 9.37,47.55 9.07,47.24 9.07,47.02 U$2.P5 | 20.54,18.48 28.19,26.14 28.19,31.55 28.55,31.55 v29,32 32,35 32,40 30,42 27.12,42 | 20.69,18.33 20.65,18.29 20.65,18.14 20.04,17.53 19.58,17.53 19.51,17.6 17.75,17.6 16.99,16.84 16.99,13.95 C2.2 16.99,13.87 16.92,13.95 15.39,13.95 U2.P$5 15.32,14.02 14.48,14.86 v11.35,14.86 | U$4.P5 27.05,42.98 27.05,42.75 27.09,42.71 27.05,42.67 26.9,42.67 26.59,42.37 22.86,42.37 v20.88,44.35 | v7.39,32.16 10.21,32.16 10.44,32.38 11.28,32.38 C11.1 | JP5.1 2.67,9.83 2.67,16.46 1.83,17.3 1.83,21.79 2.82,22.78 JP6.1
  Top 0.254: U$1.P9 25,27 C12.1 | C10.1 17.6,24.87 U$1.P48 | C11.1 13.96,32.4 U$1.P36
  Top 0.305: C13.1 21.4,36.45 U$1.P24 | 27.12,42 27,42.12 U$4.P5
  Bottom 0.152: v20.88,44.35 18.75,46.48 18.75,46.94 JP4.1 | v29,32 v27.89,32.46 | JP6.1 2.82,22.78 1.52,24.08 1.52,27.96 2.97,29.41 2.97,29.95 3V71.TP 3.05,30.02 3.43,30.02 4.88,31.47 6.71,31.47 v7.39,32.16 | v11.35,14.86 8,11.51 7.24,11.51 6.93,11.81 4.72,11.81 2.74,9.83 JP5.1
6V
  Top 0.305: LD1.P$1 33,23 31,23 30,22 30,17 28.93,15.93 21.49,15.93 21.18,15.62 21.18,13.64 21.25,13.5 21.25,12.82 21.34,12.72 22.02,12.04 22.63,12.04 C3.P$1 | C3.P$1 23.32,11.28 23.32,11.12 22.71,10.52 22.71,8 U$9.CATHODE 22.55,7.92 22.25,7.92 20.12,5.79 20.12,4.95 C15.2 19.96,4.8 18.06,4.8 R17.P$2 | U$5.2 25.98,10.21 25.98,10.59 25.22,11.35 23.39,11.35 C3.P$1
ADC0  (via drill 0.3)
  Top 0.152: U$1.P10 23.85,28.88 24,28.88 24.38,28.5 24.54,28.5 27.28,31.24 27.28,36.96 27.58,37.26 27.58,38.63 28.35,39.4 v28.35,40.77
  Bottom 0.152: v28.35,40.77 28.35,41 24.54,44.81 JP3.5
ADC1  (via drill 0.3)
  Top 0.152: v23.09,29.79 23.47,29.79 23.93,29.34 24.08,29.34 U$1.P11
  Bottom 0.152: v23.09,29.79 23.09,30.1 23.01,30.18 23.01,30.63 28.96,36.58 28.96,59.82 24.54,64.24 JP3.6
ADC2  (via drill 0.3)
  Top 0.152: v17.83,30.56 18.06,30.33 23.77,30.33 24.46,29.64 U$1.P12
  Bottom 0.152: v17.83,30.56 14.71,27.43 14.55,27.43 11.66,24.54 9.45,24.54 6.25,21.34 3.96,21.34 2.9,20.27 JP6.3
ADC3  (via drill 0.3)
  Top 0.152: v24.54,30.48 24.54,31.7 U$1.P13 | v17.75,19.36 10.59,19.36 10.59,18.9 8,16.31 v8,16
  Bottom 0.152: v24.54,30.48 24.54,26.14 v17.75,19.36 | v8,16 4.57,16 2.9,17.68 JP6.5
BOOT0
  Top 0.152: U$1.P44 17.07,27.2 17.22,27.2 17.6,27.58 18.21,27.58 21.72,24.08 25.6,24.08 27.89,26.36 27.89,31.7 29.11,32.92 29.11,38.33 R1.P$2 29.18,38.41 29.18,40.69 28.35,41.53 22.94,41.53 20.34,44.12 20.34,44.58 21.26,45.49 21.26,46.94 JP4.2
COARSE1
  Top 0.152: U$2.P6 8.31,47.02 7.92,47.02 6.55,48.39 3.81,48.39 3.05,49.15 R8.P$1
FINE1  (via drill 0.3)
  Top 0.152: v10.36,47.02 9.68,47.02 U$2.P4 | v9.3,48.08 8.08,48.08 7.01,49.15 R12.P$1 6.93,49.15 5.03,49.15 R11.P$1
  Bottom 0.152: v9.3,48.08 v10.36,47.02
FINE3
  Top 0.152: U$4.P4 27.66,43.05 28.88,43.05 30.94,45.11 R39.P$1 31.01,45.19 32.99,45.19 R40.P$1
GND  (via drill 0.3)
  Top 0.254: 13.49,12.57 14.57,12.57 15,13 16.15,13 C2.1
  Top 0.305: C12.2 25.4,25.9 24.09,27.21 | 24.09,27.21 U$1.P8 | C10.2 16.4,23.85 | 16.4,23.85 16.4,24.38 U$1.P47 | 14.08,32.98 13.46,33.6 C11.2 12.5,33.53 11.35,33.53 10.9,33.07 9.68,33.07 U$13.ANODE | 14.08,32.98 U$1.P35 | C13.2 22.6,36.95 21.86,36.2 | 21.86,36.2 U$1.P23 | R15.P$2 24.06,16.77 v25.05,16.77 25.96,16.77 C8.P$2 C14.P$2 | v9.98,37.8 9.98,37.03 U$12.P2 | v30.86,37.26 30.86,38.33 R1.P$1 | v21.95,36.12 21.86,36.2 | v14.1,32.99 14.08,32.98 | v24,27.13 24.09,27.21 | v16.38,23.85 16.4,23.85 | C2.1 17.15,12 C3.P$2 19.98,12 20.9,11.07 | 17.37,8.99 U$8.2 | C9.P$2 8,6.78 9.98,6.78 C17.P$2 | 10.06,4.12 10.06,3.81 C18.P$2 | 10.06,4.12 10.82,4.88 10.82,5.87 10.06,6.63 C17.P$2 | R18.P$1 9.98,8.08 9.98,6.93 C17.P$2 | 8.91,12.19 R35.P$1 9.07,12.19 v9.98,12.19 10.97,12.19 C1.2 11.12,12.12 11.81,11.43 13.34,11.43 13.49,11.58 13.49,12.57 13.11,12.95 U2.P$2 | 10.06,4.12 9.98,4.19 9.91,4.12 v6.63,4.12 | 12.19,62.94 12.19,59.82 8.76,56.39 7.54,56.39 7.01,56.92 v7.01,57.38 7.01,58.22 LED1.C | 12.19,62.94 12.95,63.7 C19.P$2 13.11,63.78 15.93,63.78 C20.P$2 | 12.19,62.94 10.44,64.69 6.71,64.69 6.25,64.24 6.25,63.7 5.03,62.48 5.03,62.26 LED4.C | LED2.C 4.95,58.22 4.57,58.22 v3.5,57.15 2.67,56.31 1.98,56.31 1.22,55.55 1.22,47.55 2.97,45.8 R26.P$2 3.62,45.75 v4,45.38 | v8.99,44.2 8.99,44.96 U$2.P2 | v26.98,40.23 26.98,41 U$4.P2 | v7.01,61.34 7.01,62.18 LED3.C | v12.04,55.55 12.04,54.79 R22.P$1 | v17.3,55.7 17.3,55.02 U$7.5 | v22.33,55.7 22.33,55.02 U$15.5 | v27.36,55.7 27.36,55.02 U$16.5 | v32.31,55.7 32.31,55.02 U$17.5 | v34.59,63.02 33.68,63.02 U$10.ANODE | v25.83,12.34 25.07,12.34 U$5.5 | R4.P$1 7.92,35.28 v7.09,35.28 6.48,35.28 5.11,36.65 4.34,36.65 J1.5
  Top 0.305: R42.P$1 22.02,5.71 22.48,5.71 23.93,4.27 R38.P$1 24.16,4.27 25.22,4.27 26.36,3.12 26.67,3.12 27.36,2.44 | v18.36,8.99 17.53,8.99 U$8.2 | C16.P$2 29.72,2.82 28.5,2.82 28.04,3.28 U3.P$2 28.04,3.12 27.36,2.44 | 27.36,2.44 26.14,1.22 14.78,1.22 14.4,1.6 14.4,6.4 15.62,7.62 15.62,7.7 16.84,8.91 17.22,8.91 U$8.2
  Bottom 0.305: v4,45.38 4,45.25 4.25,45 4,45
  pour Bottom: 0,0 38,0 38,66 0,66
LASER_EN  (via drill 0.3)
  Top 0.152: 30,7 31.85,5.15 31.85,2.21 31.32,1.68 31.32,1.14 R43.P$2 | v23.16,21.87 19.36,25.68 v19.28,25.68 | v19.89,29.03 16.84,29.03 16.08,28.27 U$1.P41
  Top 0.254: v30,15 30,7
  Bottom 0.152: v23.16,21.87 v30,15 | v19.28,25.68 19.13,25.83 19.13,27.05 19.89,27.81 v19.89,29.03
LASER_PWM_IN  (via drill 0.3)
  Top 0.152: 19.85,18.1 15.24,22.71 15.24,28.19 15.62,28.57 U$1.P40 | 19.85,18.1 19.96,17.98 | 17.96,16.77 R7.P$2 18.06,16.76 18.67,16.76 v18.97,17.07 | v19.81,18.06 19.85,18.1
  Bottom 0.152: v18.97,17.07 18.97,17.22 v19.81,18.06
MISO  (via drill 0.3)
  Top 0.152: v24.69,33.07 24.46,33.3 23.93,33.3 23.47,32.84 U$1.P16 | v8.61,20.8 8.61,19.66 6.4,17.45 6.4,11.35 5.33,10.29 5.33,9.83 JP5.2
  Bottom 0.152: v24.69,33.07 24.46,33.3 22.25,33.3 18.82,29.87 18.82,29.41 18.44,29.03 18.44,28.96 18.21,28.73 18.21,28.12 10.9,20.8 v8.61,20.8
MOSI  (via drill 0.3)
  Top 0.152: v26.75,32.31 25.45,33.6 23.62,33.6 23.24,33.22 23.09,33.22 U$1.P17 | v28.73,30.33 28.73,29.86 29.57,28.8 29.52,28.75 29.05,27.65 29.05,19.45 27.73,18.12 22.48,18.12 v21.88,17.52
  Bottom 0.152: v28.73,30.33 v26.75,32.31 | 21.57,17.48 21.65,17.48 21.7,17.52 v21.88,17.52 | 21.57,17.48 21.5,17.48 | 21.57,17.48 21.57,17.75 21.49,17.83 20.73,17.07 20.73,16.61 12.72,8.61 6.63,8.61 5.33,7.32 JP5.4
N$1
  Top 0.152: U3.P$3 25.98,2.36 25.68,2.06 23.77,2.06 R25.P$1 23.77,2.13 22.02,3.89 22.02,4.19 R42.P$2
N$2
  Top 0.152: 18.44,35.66 U$1.P25 18.36,35.66 17.91,36.12 16.23,36.12 15.24,37.11 15.24,41.3 10.67,45.87 8.15,45.87 6.93,47.09 3.2,47.09 1.91,48.39 1.91,55.17 2.36,55.63 3.96,55.63 5.94,57.61 5.94,58.37 6.48,58.9 9.45,58.9 9.83,59.28 9.83,62.71 9.6,62.94 6.55,62.94 6.33,62.71 6.33,62.41 5.33,61.42 3.12,61.42 2.21,60.5 2.21,59.21 2.97,58.45 2.97,58.22 R2.P$2
N$3
  Top 0.152: LED2.A 4.95,59.82 3.05,59.82 R2.P$1
N$4
  Top 0.152: 11.2,14.02 11.05,13.87 C1.1 | C1.1 10.97,13.79 9.07,13.79 R35.P$2 9.07,13.87 9.07,15.32 D1.CATHODE | U2.P$3 12.65,12.12 12.34,12.12 11.73,12.72 11.73,12.95 10.97,13.72 C1.1 | 11.2,14.02 12.65,14.02 U2.P$1 | 11.2,14.02 C1.1
N$5
  Top 0.152: R4.P$2 7.92,36.8 5.56,36.8 5.03,37.34 4.34,37.34 J1.4
N$6
  Top 0.152: R7.P$1 18.06,15.32 19.96,15.32 R13.P$2
N$7
  Top 0.152: U$4.P6 26.36,43.05 26.36,43.2 28.27,45.11 28.96,45.11 R36.P$1
N$8
  Top 0.152: R11.P$2 5.03,50.83 6.93,50.83 R12.P$2 7.01,50.83 8.99,50.83 R24.P$1
N$9
  Top 0.152: R13.P$1 20.02,16.77 21.93,16.77 R14.P$2
N$10  (via drill 0.3)
  Top 0.152: 8.08,49.91 8.31,49.91 8.99,49.23 R24.P$2 | 8.08,49.91 4.5,49.91 3.58,50.83 3.05,50.83 R8.P$2 | v20.42,59.51 20.04,59.13 20.04,58.75 R28.P$2 | v21.49,59.51 21.49,59.21 21.95,58.75 C5.P$1 | v23.39,53.42 23.09,53.11 22.33,53.11 U$15.4 | v8.08,49.99 8.08,49.91
  Bottom 0.152: v23.39,53.42 23.39,57.61 v21.49,59.51 v20.42,59.51 18.44,59.51 8.91,49.99 v8.08,49.99
N$11
  Top 0.152: R14.P$1 22.02,15.32 23.93,15.32 R15.P$1 24,15.32 25.98,15.32 C8.P$1 | 26.06,15.24 C8.P$1 | 26.1,15.1 C8.P$1 | 27.51,15.25 27.51,11.28 26.98,10.74 26.98,10.21 U$5.3
  Top 0.305: C14.P$1 27.51,15.25 C8.P$1
N$12
  Top 0.152: LED1.A 7.01,59.82 8.99,59.82 R3.P$1
N$13  (via drill 0.3)
  Top 0.152: 18.06,35.36 U$1.P26 18.14,35.28 18.75,34.67 v19.05,34.67 | v7.85,57 8.99,58.14 R3.P$2
  Bottom 0.152: v7.85,57 7.85,50.52 4.5,47.17 4.5,46.02 4.8,45.72 6.17,45.72 9.07,48.62 10.44,48.62 19.05,40.01 v19.05,34.67
N$14
  Top 0.152: 4.34,39.32 J1.1 | 6.02,45.57 6.02,45.8 L1.2
  Top 0.305: 4.34,39.32 4.95,39.32 6.53,40.02 6.78,42.03 7.5,43 7.53,44.93 6.02,45.57
N$15
  Top 0.152: U$9.ANODE 19.28,8 17.45,8 U$8.1 17.3,7.92 17.3,5.94 15.7,4.34 U$14.P$2
  Top 0.254: U$14.P$2 15.62,4.28 | 17.35,8 U$8.1
N$16
  Top 0.305: U1.P$3 28.04,5.79 28.04,14.1 29.26,15.32 29.26,15.54 33.53,19.81 33.53,19.96 LD1.P$3
N$17  (via drill 0.3)
  Top 0.305: 26.98,11.35 26.98,11.43 | 26.98,11.43 26.98,12.27 U$5.4 | v26.14,11.43 26.98,11.43 | 23.39,6.33 23.93,5.79 R38.P$2 24.08,5.64 24.92,4.8 25.98,4.8 U1.P$2 | 23.39,6.33 23.32,6.4 21.41,6.4 21.18,6.17 21.18,3.81 22.17,2.82 22.17,2.06 R25.P$2 | v24.23,10.74 24.23,9.98 23.47,9.22 23.47,6.4 23.39,6.33
  Bottom 0.305: 24.84,10.13 24,9.3 24,9.07 LASER71.TP | 24.84,10.13 v26.14,11.43 | v24.23,10.74 24.84,10.13
N$18
  Top 0.152: 4.27,34.75 J1.S4 | 1.48,34.75 J1.S2 1.6,34.82 | 1.6,36.73 J1.S6 1.6,36.8 | 1.6,39.24 J1.S5 | 1.6,39.17 J1.S5 | 3.05,42.44 3.09,42.41 3.05,42.37 | 3.05,44.2 R26.P$1 | 4.27,41.22 J1.S3 | 1.6,41.3 J1.S1 1.6,41.22 | 1.6,39.32 J1.S5
  Top 0.305: 1.48,34.75 4.27,34.75 | 1.6,34.82 1.6,36.73 | 1.6,39.17 1.6,36.8 | 3.05,42.44 3.05,44.2 | 4.27,41.22 3.09,42.41 | 3.05,42.37 2.67,42.37 1.6,41.3 | 1.6,39.32 1.6,41.22
N$19
  Top 0.305: R16.P$2 25.76,8.46 25.76,6.93 25.98,6.71 U1.P$1
N$20
  Top 0.152: R16.P$1 24.31,8.53 24.31,9.45 24.99,10.13 U$5.1
N$21
  Top 0.152: U3.P$1 28.04,1.37 28.27,1.14 29.72,1.14 R43.P$1 29.72,1.22 C16.P$1
N$22
  Top 0.152: R10.P$1 12.04,51.82 12.04,53.19 R22.P$2
N$24
  Top 0.152: LED3.A 7.01,63.78 8.99,63.78 R20.P$1
N$25
  Top 0.152: 17.37,9.91 U$8.3 | C15.1 19.96,3.2 18.06,3.2 R17.P$1 17.98,3.28 17.98,3.66 17.3,4.34 17.3,5.18 19.2,7.09 19.89,7.09 20.04,7.24 20.04,8.76 18.9,9.91 17.45,9.91 U$8.3 | R18.P$2 10.06,9.68 13.72,9.68 14.02,9.37 16.46,9.37 16.99,9.91 17.3,9.91 U$8.3
N$26
  Top 0.152: R19.P$2 8,9.91 8.61,9.91 9.3,10.59 14.02,10.59 14.63,9.98 U$8.4
N$27
  Top 0.152: LED4.A 4.95,63.78 3.05,63.78 R21.P$1
N$28
  Top 0.152: U$1.P27 17.75,34.98 17.37,35.36 16.54,35.36 14.94,36.96 14.94,41.15 10.52,45.57 8,45.57 6.78,46.79 3.05,46.79 1.6,48.23 1.6,55.32 2.21,55.93 3.81,55.93 5.64,57.76 5.64,59.51 6.55,60.43 6.86,60.43 8.53,62.1 8.99,62.1 R20.P$2
N$29  (via drill 0.3)
  Top 0.152: 17.37,34.52 U$1.P28 17.37,34.59 16.92,35.05 15.32,35.05 9.14,41.22 v7.32,41.22 | v5.41,43.13 3.73,44.81 2.82,44.81 0.84,46.79 0.84,59.59 2.97,61.72 2.97,62.1 R21.P$2
  Bottom 0.152: v7.32,41.22 v5.41,43.13
N$30
  Top 0.152: R30.P$2 31.01,50.83 32.99,50.83 R33.P$2 33.07,50.83 34.98,50.83 R34.P$1
N$31
  Top 0.152: R6.P$2 5.03,54.86 6.93,54.86 R31.P$2 7.01,54.86 8.99,54.86 R32.P$1
N$32
  Top 0.152: R29.P$2 25.07,58.75 26.98,58.75 C6.P$1 27.05,58.67 27.05,58.29 28.19,57.15 28.19,54.03 27.28,53.11 U$16.4 27.28,53.03 26.67,53.03 26.14,52.5 26.14,52.05 27.28,50.9 28.96,50.9 R27.P$2 29.03,50.83 29.79,50.06 33.53,50.06 34.37,49.23 34.98,49.23 R34.P$2
N$35
  Top 0.152: R39.P$2 31.01,46.86 32.99,46.86 R40.P$2 33.07,46.86 34.98,46.86 R41.P$1
N$36
  Top 0.152: R36.P$2 29.03,46.79 29.64,46.79 30.48,45.95 34.21,45.95 34.98,45.19 R41.P$2 34.9,45.34 35.81,46.25 35.81,51.51 32.96,54.37 | R37.P$2 30.02,58.75 31.93,58.75 C7.P$1 32,58.67 32.38,58.67 33.15,57.91 33.15,54.56 32.96,54.37 | 32.96,54.37 32.31,53.72 32.31,53.11 U$17.4
NRST  (via drill 0.3)
  Top 0.152: U$1.P7 22.71,27.89 22.55,27.89 20.42,30.02 17.3,30.02 16.76,30.56 14.94,30.56 11.2,26.82 11.2,26.67 10.9,26.36 10.44,26.36 9.91,26.9 v7.47,26.9
  Bottom 0.152: v7.47,26.9 6.4,27.96 6.02,27.96 NRST71.TP
OUT  (via drill 0.3)
  Top 0.152: 16.48,57.3 16.99,57.3 C4.P$2 17.07,57.3 17.37,57.3 19.43,59.36 19.43,61.72 JP3.1 | 16.48,57.3 15.01,57.3 R23.P$1 14.94,57.23 14.71,57 14.71,55.02 U$7.1 | 16.48,57.3 v16.48,56
  Bottom 0.152: TP3.TP 16,55.52 v16.48,56
OUT1  (via drill 0.3)
  Top 0.152: 20.95,57.3 21.95,57.3 C5.P$2 | 20.95,57.3 20.04,57.3 R28.P$1 19.96,57.23 19.74,57 19.74,55.77 | 19.74,55.77 19.74,55.02 U$15.1 | 20.95,57.3 20.95,62.79 19.51,64.24 JP3.2 | 19.74,55.77 v20.23,55.77
  Bottom 0.152: v20.23,55.77 TP4.TP
OUT2  (via drill 0.3)
  Top 0.152: R29.P$1 25.07,57.3 26.98,57.3 C6.P$2 | 24.77,55.77 24.77,57 24.99,57.23 R29.P$1 | 24.77,55.77 24.77,55.02 U$16.1 | R29.P$1 25.07,57.38 25.07,57.53 22.02,60.58 22.02,61.72 JP3.3 | 24.77,55.77 v25.23,55.77
  Bottom 0.152: v25.23,55.77 TP5.TP
OUT3  (via drill 0.3)
  Top 0.152: R37.P$1 30.02,57.3 31.93,57.3 C7.P$2 | 29.72,55.77 29.72,57 29.95,57.23 R37.P$1 | 29.72,55.77 29.72,55.02 U$17.1 | R37.P$1 29.79,57.15 25.6,61.34 25.6,62.1 24.46,63.25 23.01,63.25 22.02,64.24 JP3.4 | 29.72,55.77 v30.23,55.77
  Bottom 0.152: v30.23,55.77 TP6.TP
SCK  (via drill 0.3)
  Top 0.152: v22.17,30.86 U$1.P15
  Bottom 0.152: v22.17,30.86 22.17,25.3 19.89,25.3 7.62,13.03 7.62,12.72 3.43,12.72 1.14,10.44 1.14,8.84 2.67,7.32 JP5.3
SCL  (via drill 0.3)
  Top 0.152: v18.75,28.5 21.26,28.5 22.17,27.58 22.33,27.58 U$1.P6
  Bottom 0.152: v18.75,28.5 18.75,28.19 18.67,28.12 18.67,27.89 11.05,20.27 5.41,20.27 JP6.4
SDA  (via drill 0.3)
  Top 0.152: v17.45,28.35 17.83,27.96 21.18,27.96 21.95,27.2 U$1.P5 | v8.61,22.94 5.49,22.94 5.41,22.86 JP6.2
  Bottom 0.152: v17.45,28.35 12.04,22.94 v8.61,22.94
SPI_CS  (via drill 0.3)
  Top 0.152: v22.17,31.62 22.17,32.84 22.71,33.38 22.71,33.53 U$1.P18 | v6.48,10.67 6.48,9.53 5.71,8.76 5.33,8.76 4.27,7.7 4.27,7.32 2.74,5.79 2.74,4.72 JP5.5
  Bottom 0.152: v22.17,31.62 22.71,31.09 22.71,30.18 22.48,29.95 22.48,24.84 22.63,24.69 21.95,24 21.79,24 21.72,24.08 20.88,24.08 16.61,19.81 16.61,18.9 17.07,18.44 | 21.79,18.21 21.79,18.67 21.49,18.97 18.97,18.97 18.21,18.21 17.3,18.21 17.07,18.44 | v6.48,10.67 6.63,10.82 9.45,10.82 17.07,18.44
SWCLK  (via drill 0.3)
  Top 0.152: v13.87,28.73 13.87,28.88 14.55,29.57 U$1.P37
  Bottom 0.152: v13.87,28.73 6.55,28.73 6.4,28.88 4.88,28.88 4.04,28.04 SWCLK71.TP
SWDIO  (via drill 0.3)
  Top 0.152: v8.76,27.43 12.19,30.86 14.94,30.86 15.77,31.7 15.77,31.85 15.32,32.31 15.32,32.46 U$1.P34
  Bottom 0.152: v8.76,27.43 7.7,26.36 6.86,26.36 6.33,26.9 3.89,26.9 3.05,26.06 SWDIO71.TP
USB_DM
  Top 0.254: J1.2 10.35,38.65 10.62,38.38 10.62,37.02 U$12.P1 12.18,37 U$1.P32
USB_DP
  Top 0.254: J1.3 8.35,38 U$12.P3 9.35,36.65 10,36 12.47,36 U$1.P33
VUSB  (via drill 0.3)
  Top 0.305: 12.38,7.38 U$14.P$1 12.27,3.96 10.59,2.29 10.06,2.29 C18.P$1 | 12.38,7.38 13,8 14.65,8 U$8.5 | C17.P$1 9.98,5.26 C9.P$1 8,5.41 8,5.56 7.24,6.33 7.24,7.32 7.92,8 R19.P$1 | 12.38,7.38 12.27,7.39 10.67,8.99 8.99,8.99 8.15,8.15 R19.P$1 | U$10.CATHODE 30.33,62.94 29.18,61.8 29.18,58.37 29.41,58.14 32.31,58.14 32.77,57.68 32.77,56.77 32.61,56.62 32.31,56.62 31.39,55.7 31.39,55.32 30.1,54.03 29.72,54.03 U$17.2 29.57,53.95 28.88,53.95 v28.42,53.49 | C19.P$1 13.03,62.26 15.93,62.26 C20.P$1 16,62.1 16,60.96 17.83,59.13 17.83,58.37 17.37,57.91 14.48,57.91 13.79,57.23 13.79,54.48 | 13.79,54.48 14.25,54.03 14.55,54.03 U$7.2 14.71,54.03 19.66,54.03 U$15.2 19.81,54.03 24.69,54.03 U$16.2 24.84,54.03 v27.43,54.03 | v5.03,46.25 5.03,45.34 5.94,44.42 5.94,44.27 L1.1 6.02,44.12 6.02,41 4.88,39.85 3.5,39.85 2.9,39.87 2.88,36.12 3.62,36.12 arc-2 4.5,36.12 5.33,35.74 5.33,33.91 5.41,33.91 6.25,33.07 U$13.CATHODE | v10.67,50.98 10.67,53.11 11.66,54.1 13.41,54.1 13.79,54.48 | U$12.P5 9.98,34.98 9.98,34.67 9.3,33.98 7.32,33.98 6.4,33.07 U$13.CATHODE | R19.P$1 7.92,8.38 7.09,9.22 7.09,16 8.99,17.91 D1.ANODE 8.99,18.82 9.22,19.05 9.22,23.24 6.71,25.76 6.71,30.86 v6.63,30.94 6.63,32.77 6.48,32.92 U$13.CATHODE
  Bottom 0.305: v5.03,46.25 5.94,46.25 v10.67,50.98 | v28.42,53.49 27.89,54.03 v27.43,54.03 | v6.63,30.94 6.02,30.33 6.02,30.02 VUSB71.TP
XCOARSE_IN  (via drill 0.3)
  Top 0.152: v15.77,30.02 15.7,30.02 15.01,29.34 U$1.P38 | v15.54,35.59 8.38,42.75 8.38,44.96 U$2.P1 | v15.77,37.34 15.77,41.22 10.82,46.18 8.31,46.18 7.09,47.4 3.35,47.4 2.21,48.54 2.21,51.44 2.97,52.2 2.97,53.11 R5.P$1
  Bottom 0.152: v15.77,37.34 15.77,35.59 | 15.77,35.59 v15.77,30.02 | 15.77,35.59 v15.54,35.59
XFINE_IN  (via drill 0.3)
  Top 0.152: v16.54,30.02 15.47,28.96 15.32,28.96 U$1.P39 | v10.36,44.96 9.68,44.96 U$2.P3 | v10.21,48.08 10.21,49 9.83,49.38 9.83,51.44 8.91,52.35 7.77,52.35 7.01,53.11 R31.P$1 6.93,53.19 5.03,53.19 R6.P$1
  Bottom 0.152: v10.21,48.08 10.9,47.4 10.9,46.79 10.36,46.25 v10.36,44.96 16.69,38.63 16.69,31.55 16.15,31.01 16.15,30.56 16.54,30.18 v16.54,30.02
XSUM
  Top 0.152: C4.P$1 R23.P$2 14.94,58.67 14.4,58.67 8.99,53.26 R32.P$2 | R32.P$2 8.99,53.19 8.38,53.19 7.47,54.1 3.73,54.1 3.05,54.79 R5.P$2 | U$7.4 17.3,53.03 12.72,48.46 12.72,48.39 12.5,48.16 11.51,48.16 10.13,49.53 10.13,52.05 9.07,53.11 R32.P$2
YCOARSE_IN
  Top 0.152: U$1.P21 21.72,34.59 26.29,39.17 26.29,41 U$4.P1 26.21,41 23.01,41 20.04,43.97 20.04,48.01 21.18,49.15 28.96,49.15 R27.P$1
YFINE_IN  (via drill 0.3)
  Top 0.152: 20.88,34.52 21.26,34.9 U$1.P22 21.34,34.98 21.72,35.36 21.95,35.36 25.68,39.09 v25.68,39.32 | R33.P$1 32.99,49.15 31.01,49.15 R30.P$1 30.94,49.15 30.4,49.15 28.88,47.62 28.35,47.62 25.68,44.96 v25.68,42.9 | v26.82,39.32 27.58,40.08 27.58,41 U$4.P3
  Bottom 0.152: v26.82,39.32 v25.68,39.32 v25.68,42.9

### Text on the board
Bottom: Peachy v1.14 / Bottom Side
BlindViaText: FillOverPAD:GND:44:299 | FillOverPAD:GND:179:299